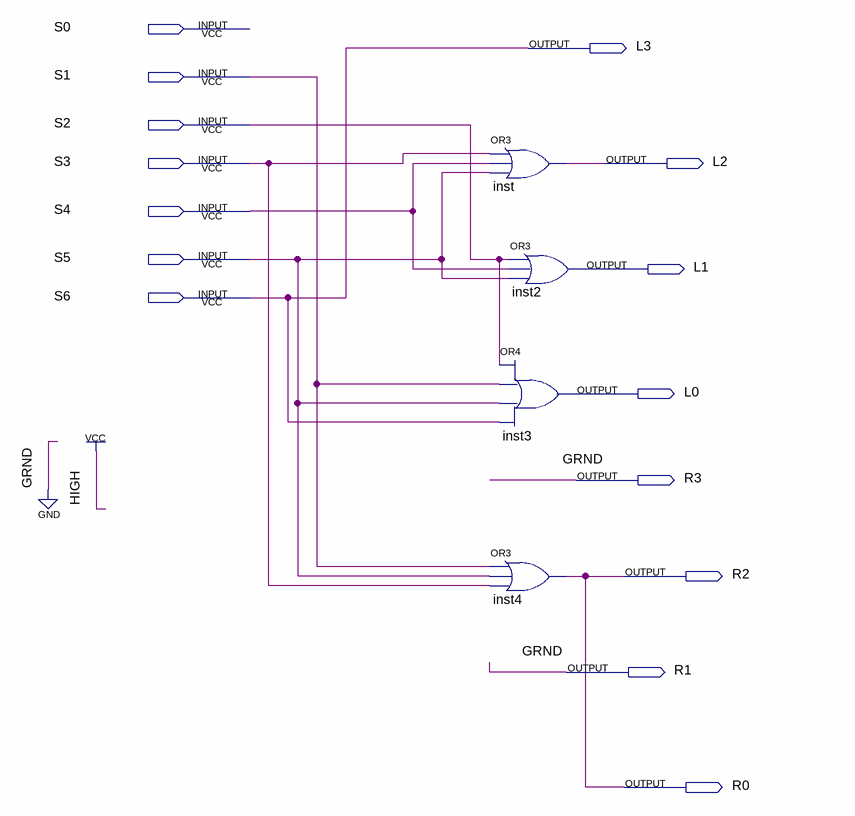
[diagram p0: schematic sheet]
// Quartus schematic BCDOutputG.bdf as structural Verilog: 4 symbols, 15 pins
module BCDOutputG (
  input  S0,
  input  S1,
  input  S2,
  input  S3,
  input  S4,
  input  S5,
  input  S6,
  output L3,
  output L2,
  output L1,
  output L0,
  output R3,
  output R2,
  output R1,
  output R0
);

  or inst (L2, S3, S4, S5);
  or inst2 (L1, S2, S4, S5);
  or inst3 (L0, S2, S1, S5, S6);
  or inst4 (R0, S1, S5, S3);

  assign L3 = S6;
  assign R1 = 1'b0;
  assign R2 = R0;
  assign R3 = 1'b0;
endmodule
